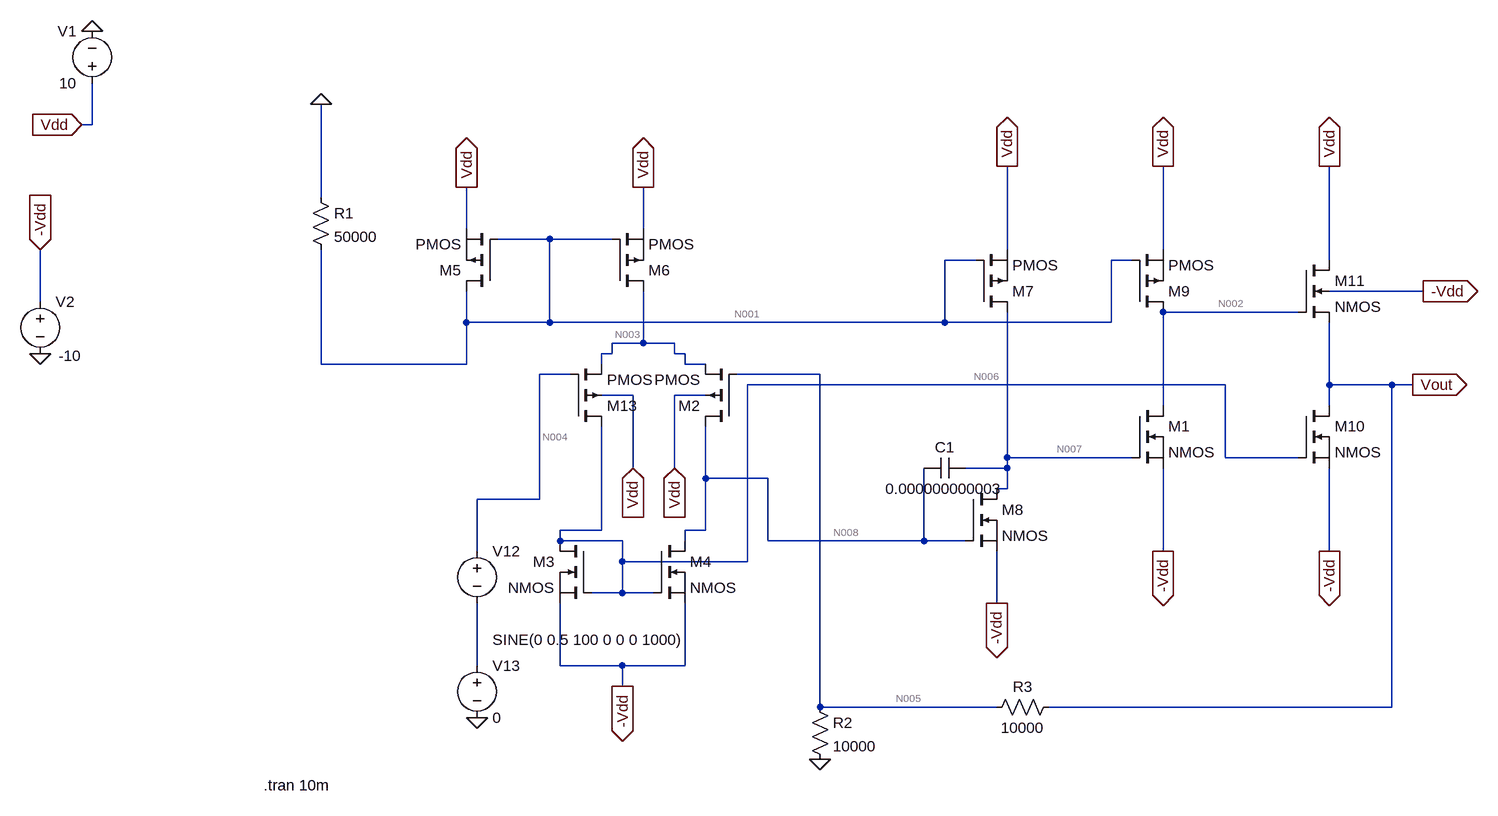
[diagram p0: schematic Op_Amp_Model_5_1_2017.asc]
Op_Amp_Model_5_1_2017.asc, the LTspice schematic file:
Version 4
SHEET 1 1584 760
WIRE -576 -272 -576 -336
WIRE -576 -272 -592 -272
WIRE -224 -160 -224 -304
WIRE 0 -112 0 -176
WIRE 272 -112 272 -176
WIRE 128 -96 48 -96
WIRE 224 -96 128 -96
WIRE 832 -80 832 -208
WIRE 1072 -80 1072 -208
WIRE 784 -64 736 -64
WIRE 1024 -64 992 -64
WIRE 1328 -64 1328 -208
WIRE 1472 -16 1328 -16
WIRE -656 0 -656 -80
WIRE 1280 16 1072 16
WIRE 0 32 0 -16
WIRE 128 32 128 -96
WIRE 128 32 0 32
WIRE 736 32 736 -64
WIRE 736 32 128 32
WIRE 992 32 992 -64
WIRE 992 32 736 32
WIRE 272 64 272 -16
WIRE 272 64 224 64
WIRE 320 64 272 64
WIRE 224 80 224 64
WIRE 224 80 208 80
WIRE 320 80 320 64
WIRE 336 80 320 80
WIRE -224 96 -224 -80
WIRE 0 96 0 32
WIRE 0 96 -224 96
WIRE 208 96 208 80
WIRE 336 96 336 80
WIRE 368 96 336 96
WIRE 160 112 112 112
WIRE 544 112 416 112
WIRE 1168 128 432 128
WIRE 1328 128 1328 32
WIRE 1424 128 1328 128
WIRE 1456 128 1424 128
WIRE 256 144 208 144
WIRE 368 144 320 144
WIRE 1072 160 1072 16
WIRE 1328 160 1328 128
WIRE 832 240 832 16
WIRE 1024 240 832 240
WIRE 1168 240 1168 128
WIRE 1280 240 1168 240
WIRE 256 256 256 144
WIRE 320 256 320 144
WIRE 832 256 832 240
WIRE 832 256 768 256
WIRE 368 272 368 192
WIRE 464 272 368 272
WIRE 832 288 832 256
WIRE 832 288 816 288
WIRE 112 304 112 112
WIRE 112 304 16 304
WIRE 208 352 208 192
WIRE 208 352 144 352
WIRE 368 352 368 272
WIRE 368 352 336 352
WIRE 144 368 144 352
WIRE 240 368 144 368
WIRE 336 368 336 352
WIRE 464 368 464 272
WIRE 704 368 704 256
WIRE 704 368 464 368
WIRE 768 368 704 368
WIRE 16 384 16 304
WIRE 1072 384 1072 256
WIRE 1328 384 1328 256
WIRE 240 400 240 368
WIRE 432 400 432 128
WIRE 432 400 240 400
WIRE 240 448 240 400
WIRE 240 448 192 448
WIRE 288 448 240 448
WIRE 816 464 816 384
WIRE 16 560 16 464
WIRE 144 560 144 464
WIRE 240 560 144 560
WIRE 336 560 336 464
WIRE 336 560 240 560
WIRE 240 592 240 560
WIRE 544 624 544 112
WIRE 816 624 544 624
WIRE 1424 624 1424 128
WIRE 1424 624 896 624
FLAG 1456 128 Vout
IOPIN 1456 128 Out
FLAG 16 640 0
FLAG 544 704 0
FLAG -592 -272 Vdd
IOPIN -592 -272 In
FLAG -576 -416 0
FLAG 0 -176 Vdd
IOPIN 0 -176 Out
FLAG 272 -176 Vdd
IOPIN 272 -176 Out
FLAG 832 -208 Vdd
IOPIN 832 -208 Out
FLAG 1072 -208 Vdd
IOPIN 1072 -208 Out
FLAG -656 80 0
FLAG -656 -80 -Vdd
IOPIN -656 -80 In
FLAG 240 592 -Vdd
IOPIN 240 592 Out
FLAG 816 464 -Vdd
IOPIN 816 464 Out
FLAG 1072 384 -Vdd
IOPIN 1072 384 Out
FLAG -224 -304 0
FLAG 256 256 Vdd
IOPIN 256 256 In
FLAG 320 256 Vdd
IOPIN 320 256 In
FLAG 1328 384 -Vdd
IOPIN 1328 384 Out
FLAG 1328 -208 Vdd
IOPIN 1328 -208 Out
FLAG 1472 -16 -Vdd
IOPIN 1472 -16 Out
SYMBOL nmos 288 368 R0
SYMATTR InstName M4
SYMBOL nmos 192 368 M0
SYMATTR InstName M3
SYMBOL pmos 784 16 M180
SYMATTR InstName M7
SYMBOL pmos 1024 16 M180
SYMATTR InstName M9
SYMBOL nmos 768 288 R0
SYMATTR InstName M8
SYMBOL cap 768 240 R90
WINDOW 0 0 32 VBottom 2
WINDOW 3 32 32 VTop 2
SYMATTR InstName C1
SYMATTR Value 0.000000000003
SYMBOL res -240 -176 R0
SYMATTR InstName R1
SYMATTR Value 50000
SYMBOL voltage -576 -320 R180
WINDOW 0 24 96 Left 2
WINDOW 3 24 16 Left 2
WINDOW 123 0 0 Left 2
WINDOW 39 0 0 Left 2
SYMATTR InstName V1
SYMATTR Value 10
SYMBOL voltage 16 368 R0
WINDOW 3 24 152 Left 2
WINDOW 123 24 124 Left 2
WINDOW 39 0 0 Left 2
SYMATTR InstName V12
SYMATTR Value SINE(0 0.5 100 0 0 0 1000)
SYMBOL voltage 16 544 R0
WINDOW 123 0 0 Left 2
WINDOW 39 0 0 Left 2
SYMATTR InstName V13
SYMATTR Value 0
SYMBOL voltage -656 -16 R0
WINDOW 3 28 99 Left 2
WINDOW 123 0 0 Left 2
WINDOW 39 0 0 Left 2
SYMATTR Value -10
SYMATTR InstName V2
SYMBOL pmos 48 -16 R180
SYMATTR InstName M5
SYMBOL pmos 224 -16 M180
SYMATTR InstName M6
SYMBOL pmos4 416 192 R180
SYMATTR InstName M2
SYMBOL pmos4 160 192 M180
SYMATTR InstName M13
SYMBOL nmos 1024 160 R0
SYMATTR InstName M1
SYMBOL res 528 608 R0
SYMATTR InstName R2
SYMATTR Value 10000
SYMBOL res 912 608 R90
WINDOW 0 0 56 VBottom 2
WINDOW 3 32 56 VTop 2
SYMATTR InstName R3
SYMATTR Value 10000
SYMBOL nmos 1280 160 R0
SYMATTR InstName M10
SYMBOL nmos4 1280 -64 R0
SYMATTR InstName M11
TEXT -312 744 Left 2 !.tran 10m

The netlist it stands for:
* Op_Amp_Model_5_1_2017.asc
M4 N008 N006 -Vdd -Vdd NMOS
M3 N006 N006 -Vdd -Vdd NMOS
M7 N007 N001 Vdd Vdd PMOS
M9 N002 N001 Vdd Vdd PMOS
M8 N007 N008 -Vdd -Vdd NMOS
C1 N007 N008 0.000000000003
R1 0 N001 50000
V1 Vdd 0 10
V12 N004 N009 SINE(0 0.5 100 0 0 0 1000)
V13 N009 0 0
V2 -Vdd 0 -10
M5 N001 N001 Vdd Vdd PMOS
M6 N003 N001 Vdd Vdd PMOS
M2 N008 N005 N003 Vdd PMOS
M13 N006 N004 N003 Vdd PMOS
M1 N002 N007 -Vdd -Vdd NMOS
R2 N005 0 10000
R3 Vout N005 10000
M10 Vout N006 -Vdd -Vdd NMOS
M11 Vdd N002 Vout -Vdd NMOS
.model NMOS NMOS
.model PMOS PMOS
.lib standard.mos
.tran 10m
.backanno
.end

* Results of the author's LTspice run, read from the files saved beside the schematic
* Operating Point, zero values left out:
*   V(n008) = -6.417 V
*   V(n006) = -7.467 V
*   V(-vdd) = -10 V
*   V(n007) = -6.417 V
*   V(n001) = 6.417 V
*   V(vdd) = 10 V
*   V(n002) = 2.533 V
*   V(n003) = 2.533 V
*   V(n005) = -82.84 nV
*   V(vout) = -165.7 nV
*   Id(M13) = -64.17 µA
*   Ib(M13) = 24.95 pA
*   Is(M13) = 64.17 µA
*   Id(M2) = -64.17 µA
*   Ib(M2) = 23.9 pA
*   Is(M2) = 64.17 µA
*   Id(M6) = -128.3 µA
*   Ib(M6) = 7.477 pA
*   Is(M6) = 128.3 µA
*   Id(M5) = -128.3 µA
*   Ib(M5) = 3.593 pA
*   Is(M5) = 128.3 µA
*   Id(M9) = -128.3 µA
*   Ib(M9) = 7.477 pA
*   Is(M9) = 128.3 µA
*   Id(M7) = -128.3 µA
*   Ib(M7) = 16.43 pA
*   Is(M7) = 128.3 µA
*   Id(M11) = 64.17 µA
*   Ib(M11) = -30.02 pA
*   Is(M11) = -64.17 µA
*   Id(M10) = 64.17 µA
*   Ib(M10) = -10.01 pA
*   Is(M10) = -64.17 µA
*   Id(M1) = 128.3 µA
*   Ib(M1) = -12.54 pA
*   Is(M1) = -128.3 µA
*   Id(M8) = 128.3 µA
*   Ib(M8) = -3.593 pA
*   Is(M8) = -128.3 µA
*   Id(M3) = 64.17 µA
*   Ib(M3) = -2.543 pA
*   Is(M3) = -64.17 µA
*   Id(M4) = 64.17 µA
*   Ib(M4) = -3.593 pA
*   Is(M4) = -64.17 µA
*   I(R3) = -8.284 pA
*   I(R2) = -8.284 pA
*   I(R1) = -128.3 µA
*   I(V2) = 449.2 µA
*   I(V1) = -577.6 µA
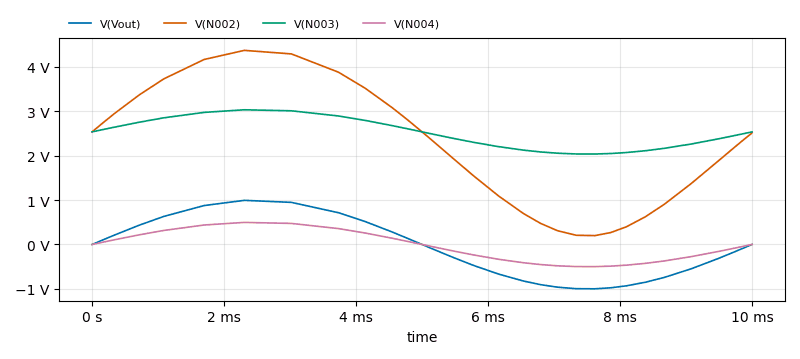
[diagram p1: Transient Analysis of Op_Amp_Model_5_1_2017.asc, plotted from the saved traces]
* Transient Analysis, 1 run:
*   V(Vout): min -997.1 mV, max 992.7 mV, average -2.865 mV, rms 704.4 mV, last 1.496 mV
*   V(N002): min 199.4 mV, max 4.366 V, average 2.412 V, rms 2.817 V, last 2.511 V
*   V(N003): min 2.035 V, max 3.03 V, average 2.532 V, rms 2.556 V, last 2.532 V
*   V(N004): min -498.6 mV, max 496.4 mV, average -1.433 mV, rms 352.2 mV, last 0 V